# Altium schematic sheet adc.SchDoc
size A4
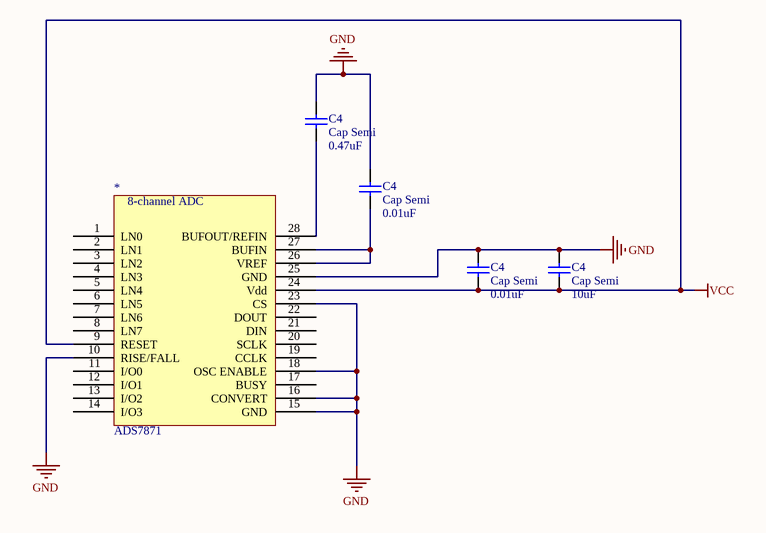
[diagram p0: adc.SchDoc]

## Parts
(Parts that share a designator on the sheet are numbered #1, #2 ... from top to bottom, then left to right.)
*  ADS7871
C4#1  Cap Semi  value 0.47uF  [C1206]
C4#2  Cap Semi  value 0.01uF  [C1206]
C4#3  Cap Semi  value 10uF  [C1206]
C4#4  Cap Semi  value 0.01uF  [C1206]

## Nets
GND: *.10(RISE/FALL) *.15(GND) *.16(CONVERT) *.18(OSC_ENABLE) *.23(CS) *.25(GND) C4#1.1 C4#2.2 C4#3.1 C4#4.2
VCC: *.9(RESET) *.24(Vdd) C4#3.2 C4#4.1
Net*_26: *.26(VREF) *.27(BUFIN) C4#2.1
Net*_28: *.28(BUFOUT/REFIN) C4#1.2

Not connected (* = marked no-connect by the designer): * 1(LN0) 2(LN1) 3(LN2) 4(LN3) 5(LN4) 6(LN5) 7(LN6) 8(LN7) 11(I/O0) 12(I/O1) 13(I/O2) 14(I/O3) 17(BUSY) 19(CCLK) 20(SCLK) 21(DIN) 22(DOUT)

## Notes on the sheet
- (in symbol ADS7871) 8-channel ADC

## Library data of the parts
C4#1-C4#4 = Cap Semi: Capacitor (Semiconductor SIM Model); Published: 8-Jun-2000; LatestRevisionDate: 29-May-2009; LatestRevisionNote: IPC-7351 Footprint Added.; PackageReference: C1206; Publisher: Altium Limited; PackageDescription: Chip Capacitor